# EAGLE design TRL-calibration-thru-reflect-match (EAGLE 9.2.2)
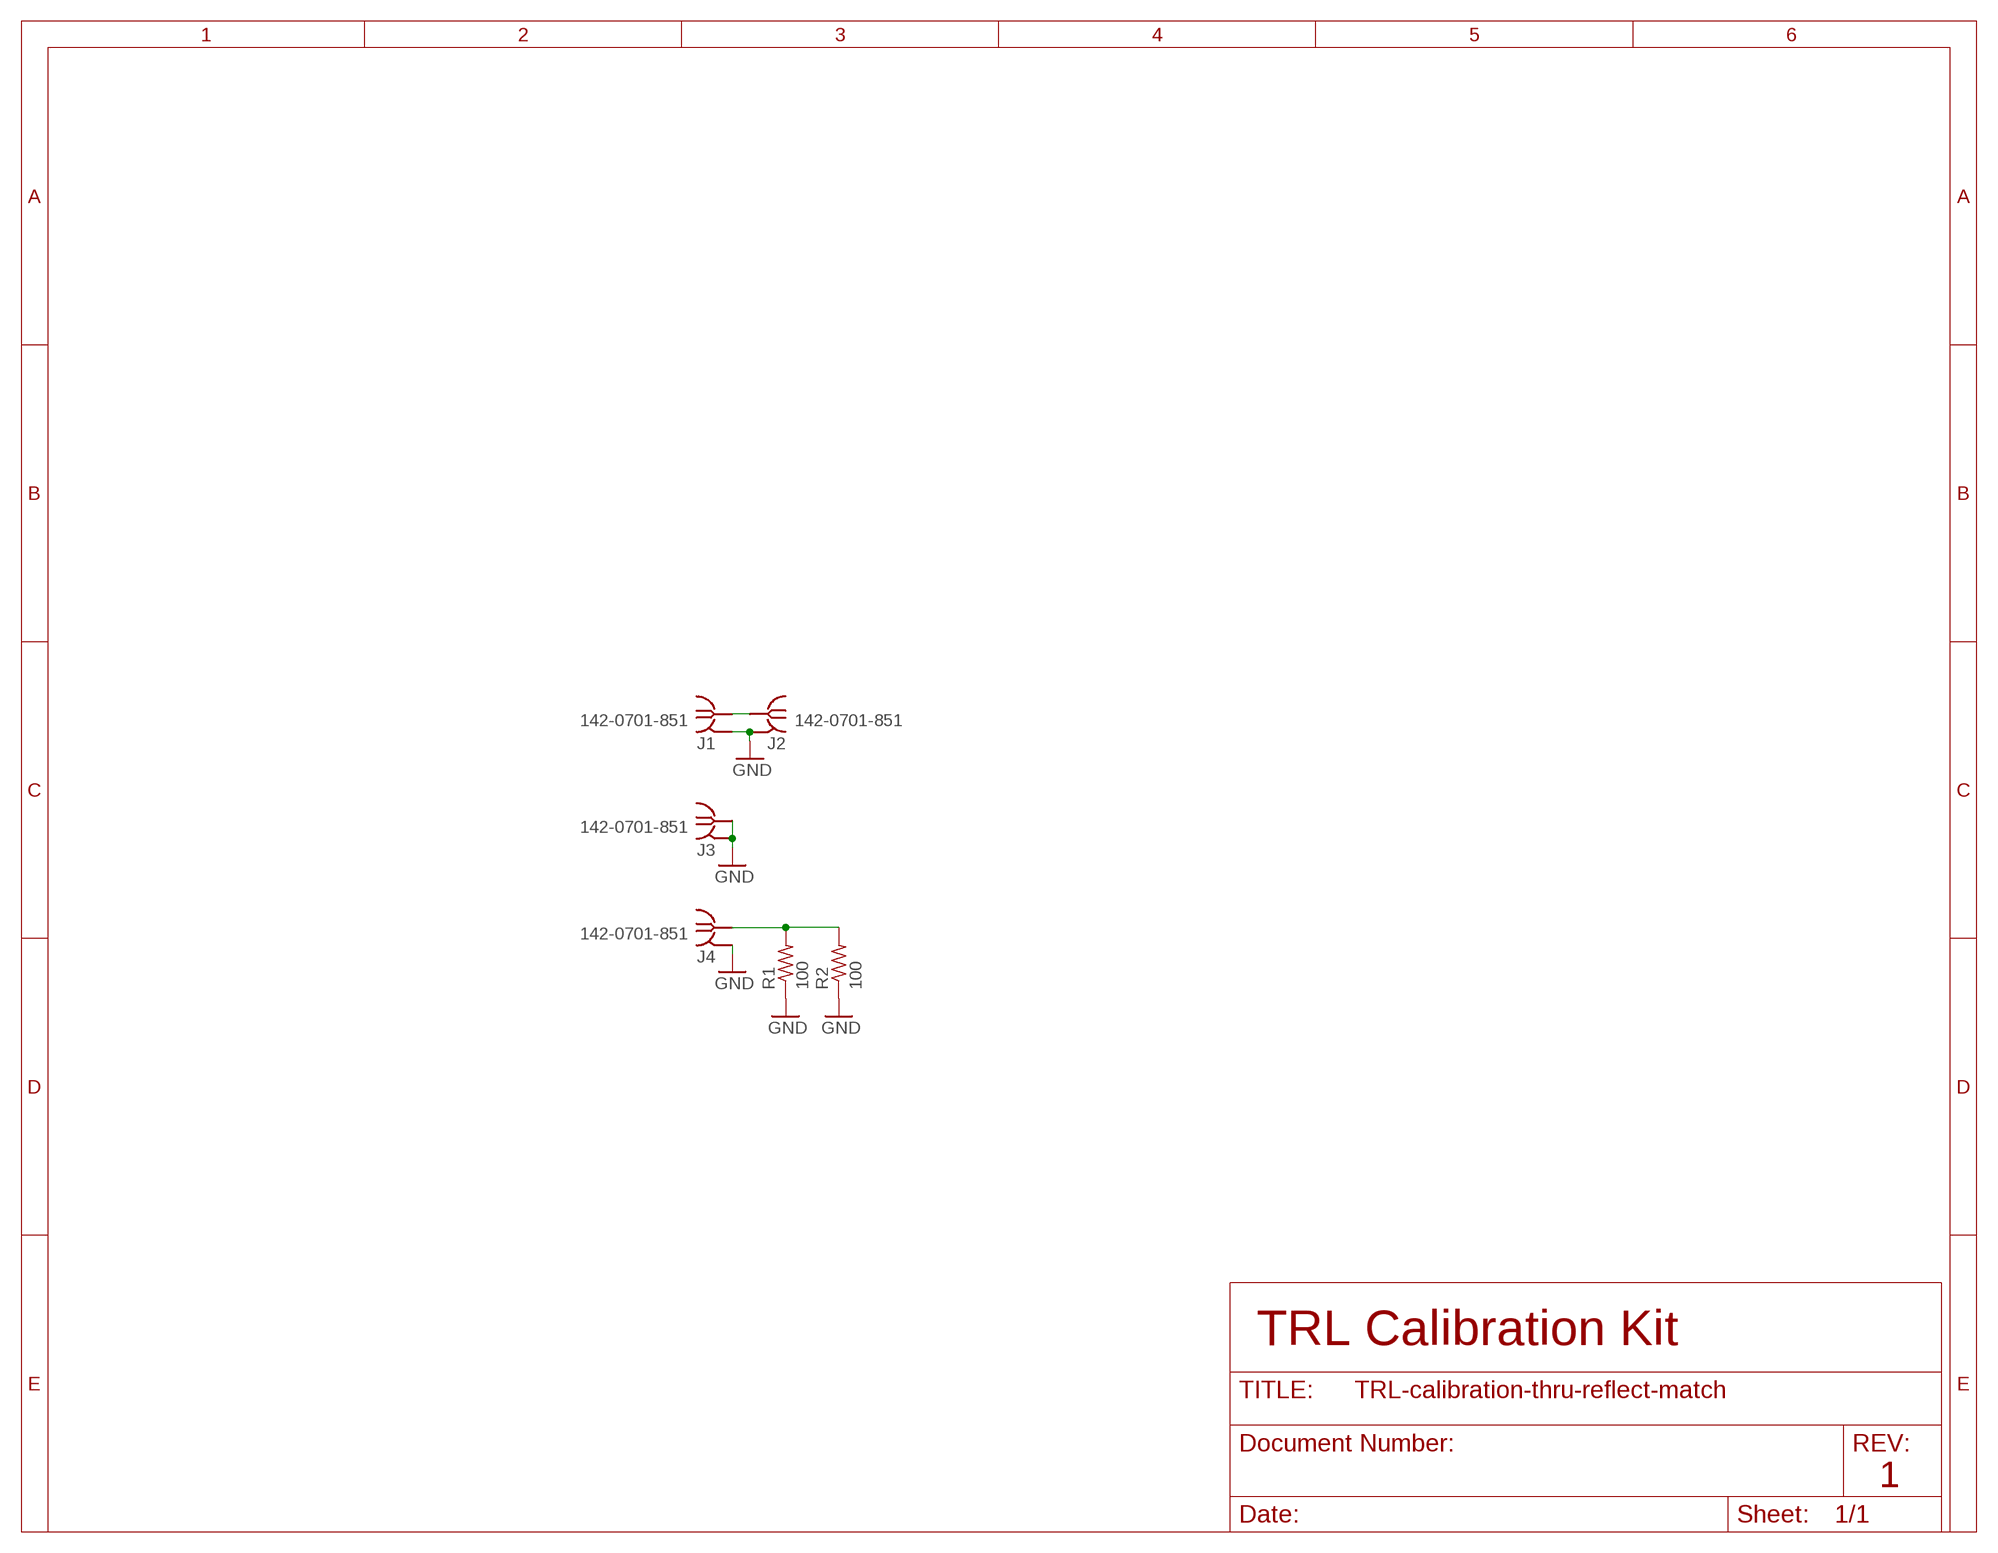
[diagram p0: schematic, sheet 1]

## Parts
J1  142-0701-851  [142-0701-851]
J2  142-0701-851  [142-0701-851]
J3  142-0701-851  [142-0701-851]
J4  142-0701-851  [142-0701-851]
R1  100  R-US_0402-C-NOSILK  [.0402-C-NOSILK]
R2  100  R-US_0402-C-NOSILK  [.0402-C-NOSILK]

## Nets
GND: J1.GND1(GND) J1.GND2(GND) J1.GND3(GND) J1.GND4(GND) J2.GND1(GND) J2.GND2(GND) J2.GND3(GND) J2.GND4(GND) J3.GND1(GND) J3.GND2(GND) J3.GND3(GND) J3.GND4(GND) J3.RF1(RF) J4.GND1(GND) J4.GND2(GND) J4.GND3(GND) J4.GND4(GND) R1.1 R2.1
MATCH [RF]: J4.RF1(RF) R1.2 R2.2
THRU [RF]: J1.RF1(RF) J2.RF1(RF)

## Notes on the sheet
- TRL Calibration Kit
- 1

## Library data of the parts
J1-J4 = J-Cinch-142-0701-851-SMA-end-launch:142-0701-851: SMA Jack 50Ω - End Launch Source: Datasheet <https://belfuse.com/resources/productinformations/cinchconnectivitysolutions/johnson/pi-ccs-john-142-0701-851.pdf>
R1 R2 = oresat-rcl:R-US_: RESISTOR, American symbol

## Net classes
1 RF: clearance 0.8 mm

## Board
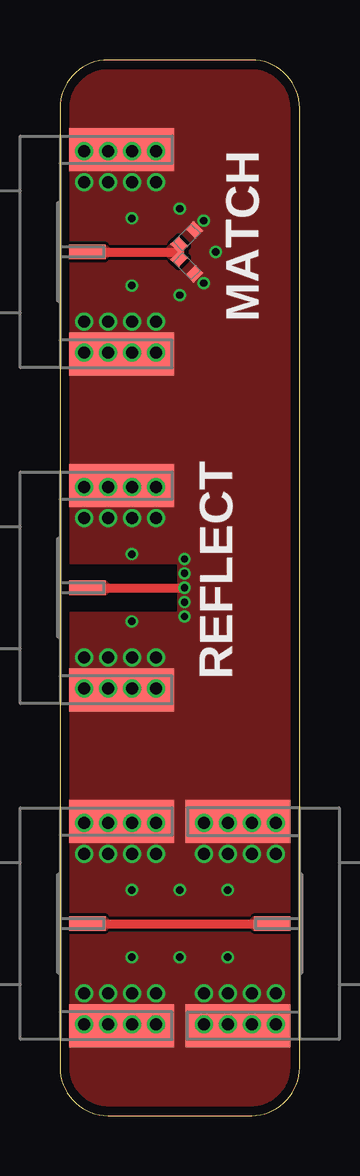
[diagram p1: board, top side]
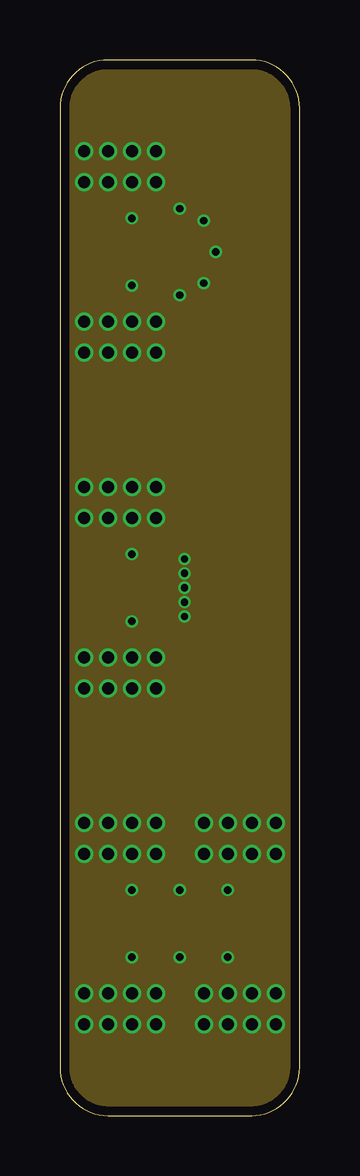
[diagram p2: board, inner layer Route2]
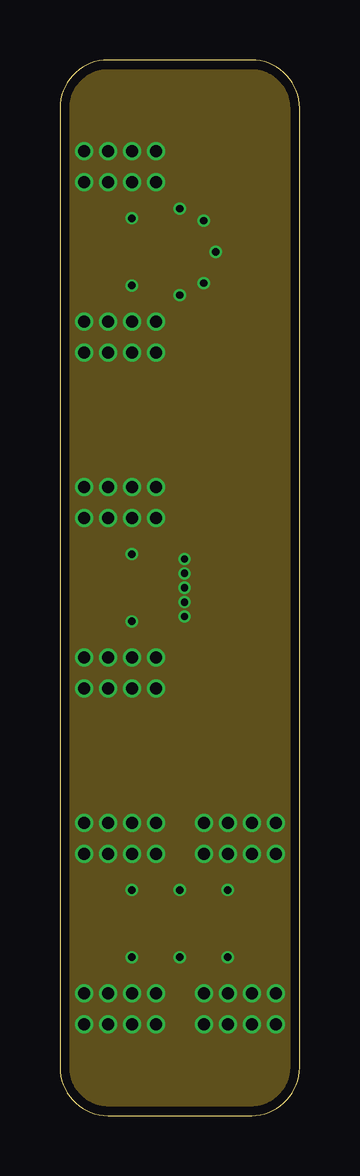
[diagram p3: board, inner layer Route15]
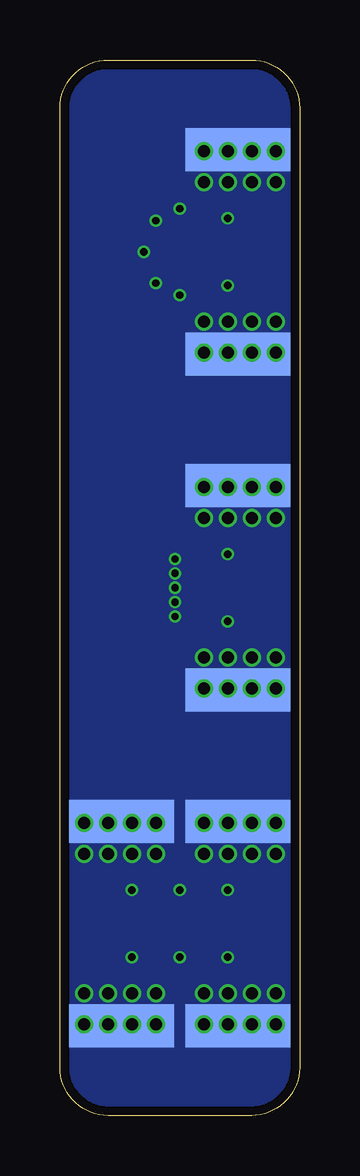
[diagram p4: board, bottom side, seen from below]

Size 10 x 44 mm. Coordinates in mm from the lower left corner, seen from the top.
Outline: 10,2 10,42 arc90 8,44 2,44 arc90 0,42 0,2 arc90 2,0 8,0 arc90 10,2
Copper layers (1*2*15*16): Top 0.035559375mm / dielectric 0.17018125mm / Route2 0.01778125mm / dielectric 47mil / Route15 0.01778125mm / dielectric 0.17018125mm / Bottom 0.035559375mm
Design rules "oshpark-4layer-tented": minimum track width 5mil, minimum drill 10mil, track to track 5mil, track to pad 5mil, pad to pad 5mil, via to via 5mil, smd to smd 5mil, copper to edge 15mil, drill to drill 6mil, minimum pad ring 4mil, minimum via ring 4mil, stop-mask expansion 2.5mil, vias tented up to drill 20mil, thermal gap 10mil

### Footprints (pad centres in the part's own frame; a part is rotated, then mirrored left to right if it is on the bottom)
142-0701-851 = smd 1.8 x 4.37: GND1 -4.255,-2.566; GND2 4.255,-2.566 | smd 1.8 x 4.37 bottom: GND3 -4.255,-2.566; GND4 4.255,-2.566 | smd 0.6 x 1.53: RF1 0,-1.146
.0402-C-NOSILK = smd 0.5 x 0.6: 1 -0.45,0; 2 0.45,0

### Placement (x,y rotation side)
J1  0,8 90 top
J2  10,8 270 top
J3  0,22 90 top
J4  0,36 90 top
R1  5.3,36.6 225 top
R2  5.3,35.4 135 top

### Tracks (layer width: path | path; a pad name or v marks a point on that pad's centre or on a via)
GND  (via drill 0.3, 0.5)
  Top 0.38: J3.RF1 v5.2,22
  other vias: 1,40.2 2,40.2 3,40.2 4,40.2 1,38.9 2,38.9 3,38.9 4,38.9 1,33.1 2,33.1 3,33.1 4,33.1 1,31.8 2,31.8 3,31.8 4,31.8 1,26.2 2,26.2 3,26.2 4,26.2 1,24.9 2,24.9 3,24.9 4,24.9 1,17.8 2,17.8 3,17.8 4,17.8 1,19.1 2,19.1 3,19.1 4,19.1 1,10.9 2,10.9 3,10.9 4,10.9 6,10.9 7,10.9 8,10.9 9,10.9 1,12.2 2,12.2 3,12.2 4,12.2 6,12.2 7,12.2 8,12.2 9,12.2 1,5.1 2,5.1 3,5.1 4,5.1 6,5.1 7,5.1 8,5.1 9,5.1 1,3.8 2,3.8 3,3.8 4,3.8 6,3.8 7,3.8 8,3.8 9,3.8 3,34.6 3,37.4 5,34.2 5,37.8 6,37.3 6,34.7 6.5,36 3,6.6 5,6.6 7,6.6 3,9.4 5,9.4 7,9.4 3,20.6 5.2,20.8 3,23.4 5.2,23.2 5.2,22.6 5.2,21.4
  pour Top (no thermals): 0,23.1 10,23.1 10,44 0,44
  pour Bottom (no thermals): 0,0 10,0 10,44 0,44
  pour Route2 (no thermals): 0,0 10,0 10,44 0,44
  pour Route15 (no thermals): 0,0 10,0 10,44 0,44
  pour Top (no thermals): 1.8,22.2 1.8,21.8 1.9,21.8 2.1,22 1.9,22.2
  pour Top (no thermals): 0,20.9 10,20.9 10,0 0,0
  pour Top: 10,24 10,20 5,20 5,24
MATCH
  Top 0.38: J4.RF1 4.98,36
  Top 0.39: 4.98,36 R1.2 R2.2
  pour Top (no thermals): 4.4,36 4.7,36.3 4.7,35.7
  pour Top (no thermals): 1.9,36.2 2.1,36 1.9,35.8
THRU
  Top 0.38: J1.RF1 J2.RF1
  pour Top (no thermals): 1.8,8.2 1.8,7.8 1.9,7.8 2.1,8 1.9,8.2
  pour Top (no thermals): 8.2,8.2 8.2,7.8 8.1,7.8 7.9,8 8.1,8.2

### Text on the board
tPlace: MATCH | REFLECT